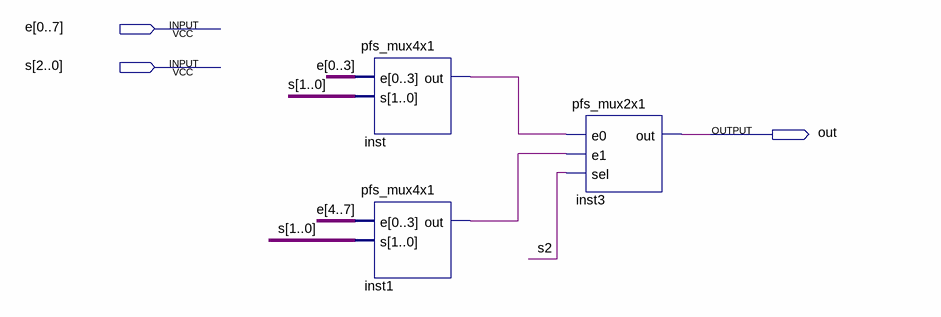
[diagram p0: schematic sheet]
// Quartus schematic pfs_mux8x1.bdf as structural Verilog: 3 symbols, 3 pins
module pfs_mux8x1 (
  input  [0:7] e,
  input  [2:0] s,
  output out
);

  wire inst1_out, inst_out;

  pfs_mux4x1 inst (.e(e[0:3]), .s(s[1:0]), .out(inst_out));
  pfs_mux4x1 inst1 (.e(e[4:7]), .s(s[1:0]), .out(inst1_out));
  pfs_mux2x1 inst3 (.e0(inst_out), .e1(inst1_out), .sel(s[2]), .out(out));
endmodule
